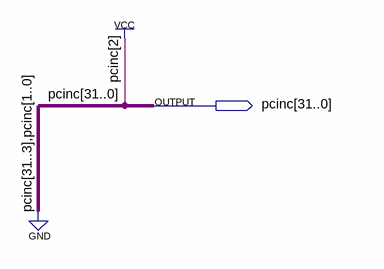
[diagram p0: schematic sheet]
// Quartus schematic pcinc32.bdf as structural Verilog: 0 symbols, 1 pins
module pcinc32 (
  output [31:0] pcinc
);


  assign pcinc = 32'b00000000000000000000000000000100;
endmodule
